# EAGLE design connectors (EAGLE 9.6.2)
Assembly variants: basic
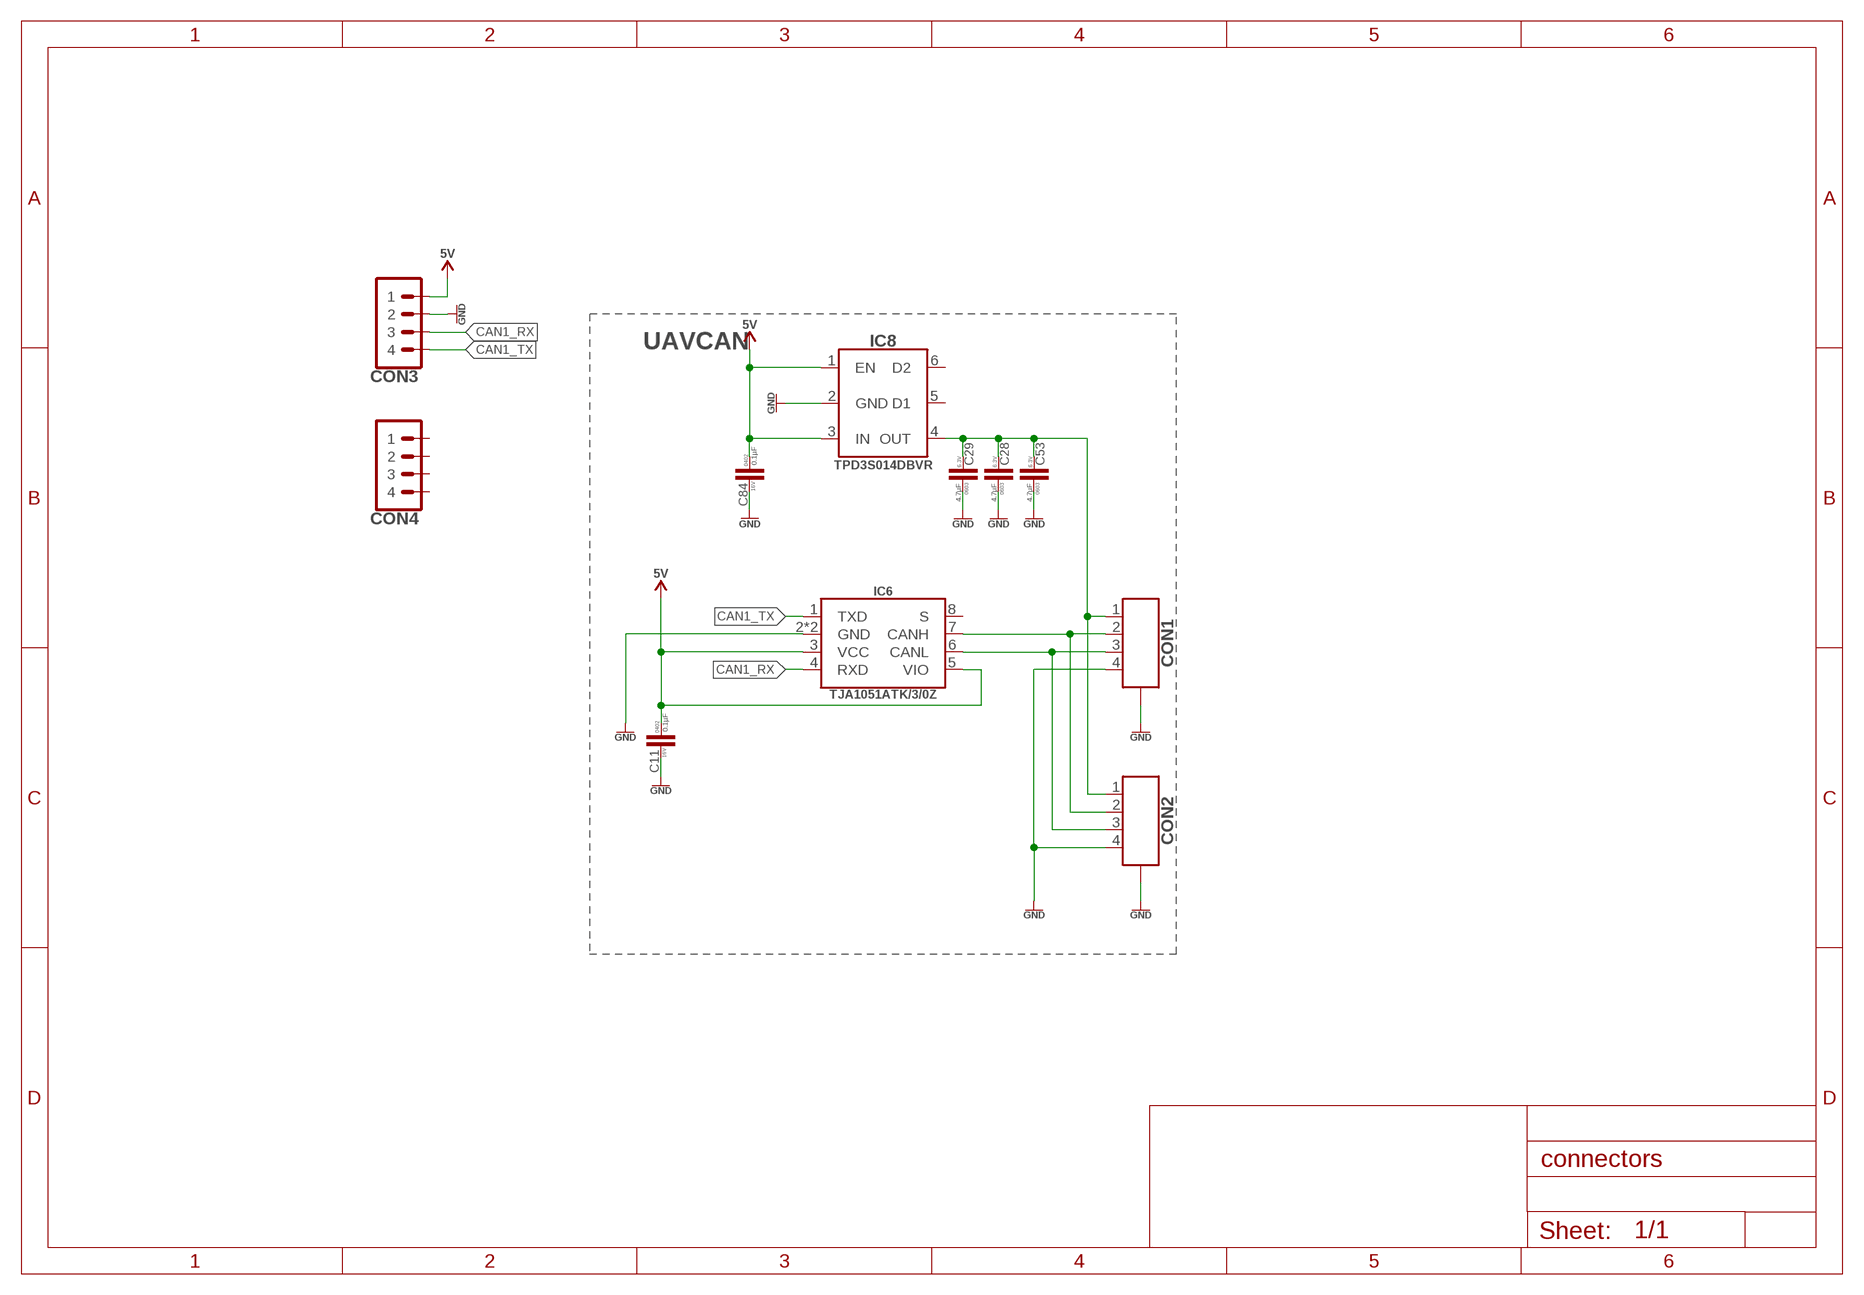
[diagram p0: schematic, sheet 1]

## Parts
C11  0.1µF  C-0402  [C0402]
C28  4.7µF  C-0603  [C0603]
C29  4.7µF  C-0603  [C0603]
C53  4.7µF  C-0603  [C0603]
C84  0.1µF  C-0402  [C0402]
CON1  CON-4P-TABS-JST_GH-RA  [JST_GH-4P-RA]
CON2  CON-4P-TABS-JST_GH-RA  [JST_GH-4P-RA]
CON3  PINHEAD_1X04-2-FEMALE  [1X04-PTH-2-FEMALE]  (not fitted in variant basic)
CON4  PINHEAD_1X04-2-FEMALE  [1X04-PTH-2-FEMALE]  (not fitted in variant basic)
IC6  TJA1051-HVSON8  [SOT782-1]
IC8  TPD3S014DBVR-SOT23-6  [SOT26]

## Nets
CAN1_RX: CON3.3 IC6.4(RXD)
CAN1_TX: CON3.4 IC6.1(TXD)
CAN1_VDD: C28.2 C29.2 C53.2 CON1.1 CON2.1 IC8.4(OUT)
GND: C11.2 C28.1 C29.1 C53.1 C84.2 CON1.4 CON1.M$0(GND) CON1.M$1(GND) CON2.4 CON2.M$0(GND) CON2.M$1(GND) CON3.2 IC6.2(GND) IC6.PAD(GND) IC8.2(GND)
N$23: CON1.2 CON2.2 IC6.7(CANH)
N$25: CON1.3 CON2.3 IC6.6(CANL)
VDD_5V: C11.1 C84.1 CON3.1 IC6.3(VCC) IC6.5(VIO) IC8.1(EN) IC8.3(IN) ; supply symbol labelled 5V
Unconnected: CON4.1 CON4.2 CON4.3 CON4.4 IC6.8(S) IC8.5(D1) IC8.6(D2)

## Notes on the sheet
- UAVCAN

## Library data of the parts
C11 C84 = rc:C; AEC-Q: ---; DIGIKEY#: 490-3261-1-ND; MANF: Murata Electronics; MANF#: GRM155R71C104KA88D; OPERATING_TEMP: -55°C ~ 125°C; PACKAGE: 0402; VOLTAGE: 16V
C28 C29 C53 = rc:C; AEC-Q: ---; DIGIKEY#: 1276-2087-1-ND; MANF: Samsung Electro-Mechanics; MANF#: CL10B475KQ8NQNC; OPERATING_TEMP: -55°C ~ 125°C; PACKAGE: 0603; VOLTAGE: 6.3V
CON1 CON2 = Connectors:CON-4P-TABS: Connector Receptacle 4 Position 0.049" (1.25mm) Tin Surface Mount; DIGIKEY#: 455-1566-1-ND; MANF: JST Sales America Inc; MANF#: SM04B-GHS-TB(LF)(SN)
CON3 CON4 = pinhead:PINHEAD_1X04
IC6 = serial_interfaces:TJA1051: 1/1 Transceiver Half CAN 8-HVSON (3x3); AEC-Q: AEC-Q100; DATA_RATE: 5Mbps; DIGIKEY#: 568-TJA1051ATK/3/0ZTR-ND; MANF: NXP USA Inc.; MANF#: TJA1051ATK/3/0Z; VOLTAGE_SUPPLY: 4.5V ~ 5.5V
IC8 = misc:TPD3S014DBVR: Current Switch Regulator High-Side 500mA SOT-23-6; DIGIKEY#: 296-38835-1-ND; MANF: Texas Instruments; MANF#: TPD3S014DBVR

## Board
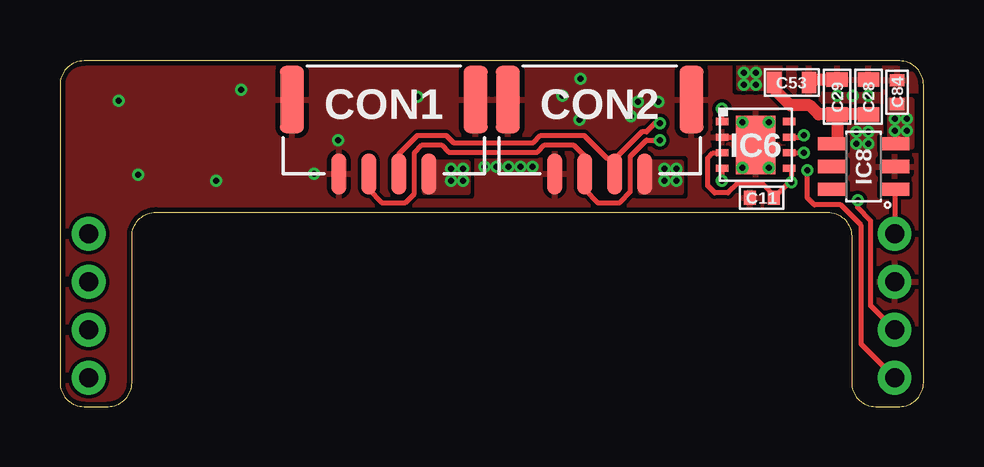
[diagram p1: board, top side]
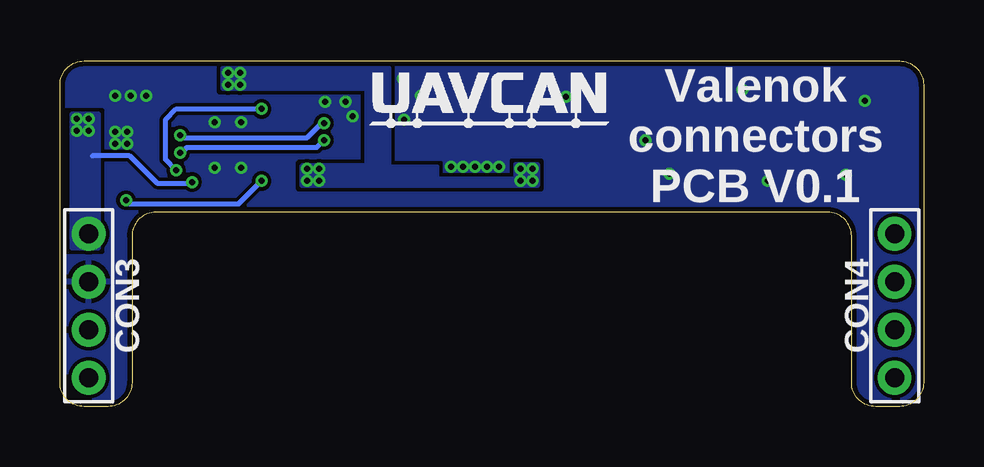
[diagram p2: board, bottom side, seen from below]

Size 36 x 14.4 mm. Coordinates in mm from the lower left corner, seen from the top.
Outline: 35,14.4 1,14.4 arc90 0,13.4 0,1 arc90 1,0 2,0 arc90 3,1 3,7.1 arc-90 4,8.1 32,8.1 arc-90 33,7.1 33,1 arc90 34,0 35,0 arc90 36,1 36,13.4 arc90 35,14.4
Copper layers (1*16): Top 0.035mm / dielectric 1.2mm / Bottom 0.035mm
Design rules "usb2can_drc *": minimum track width 0.15mm, minimum drill 0.2mm, track to track 0.15mm, track to pad 0.15mm, pad to pad 0.15mm, via to via 0.15mm, smd to smd 0.15mm, copper to edge 0.2mm, drill to drill 0.2mm, minimum pad ring 0.125mm, minimum via ring 0.125mm, stop-mask expansion 1mil, vias tented up to drill 0.31mm, thermal gap 8mil

### Footprints (pad centres in the part's own frame; a part is rotated, then mirrored left to right if it is on the bottom)
C0402 = smd 0.5 x 0.6: 1 -0.5,0; 2 0.5,0
C0603 = smd 0.6 x 0.9: 1 -0.725,0; 2 0.725,0
JST_GH-4P-RA = smd 0.6 x 1.7: 1 1.875,-2.91; 2 0.625,-2.91; 3 -0.625,-2.91; 4 -1.875,-2.91 | smd 1 x 2.8: M$0 -3.825,0.19; M$1 3.825,0.19
1X04-PTH-2-FEMALE = drill 0.8 pad 1.4: 1 -3,0; 2 -1,0; 3 1,0; 4 3,0
SOT782-1 = smd 0.525 x 0.3: 1 -1.4,0.975; 2 -1.4,0.325; 3 -1.4,-0.325; 4 -1.4,-0.975; 5 1.4,-0.975; 6 1.4,-0.325; 7 1.4,0.325; 8 1.4,0.975 | smd 1.65 x 2.45: PAD 0,0
SOT26 = smd 1.2 x 0.55: 1 -1.3,0.95; 2 -1.3,0; 3 -1.3,-0.95; 4 1.3,-0.95; 5 1.3,0; 6 1.3,0.95

### Placement (x,y rotation side)
C11  29.25,8.7 180 top
C28  33.7,12.9 270 top
C29  32.4,12.9 270 top
C53  30.5,13.5 180 top
C84  34.9,13.1 90 top
CON1  13.5,12.6 0 top
CON2  22.5,12.6 0 top
CON3  34.8,4.2 270 bottom  (not fitted)
CON4  1.2,4.2 90 bottom  (not fitted)
IC6  29,10.9 0 top
IC8  33.5,10 180 top
U$1  [UAVCAN_10X3]  23.1,11.6 0 bottom

### Tracks (layer width: path | path; a pad name or v marks a point on that pad's centre or on a via)
CAN1_RX  (via drill 0.25 pad 0.5)
  Top 0.2: IC6.4 v27.6,9.4 | CON3.3 33.8,4.2 33.8,7.75 33.25,8.3 v33.25,8.6
  Bottom 0.2: v33.25,8.6 33.1,8.45 28.55,8.45 v27.6,9.4
CAN1_TX  (via drill 0.25 pad 0.5)
  Top 0.2: IC6.1 v27.6,12.4 | CON3.4 33.4,2.6 33.4,7.55 32.55,8.41 31.45,8.41 31.15,8.71 v31.15,9.85
  Bottom 0.2: v31.15,9.85 31.6,10.3 31.6,11.95 31.15,12.4 v27.6,12.4
CAN1_VDD  (via drill 0.25 pad 0.5)
  Top 0.5: C28.2 C29.2 | C29.2 32.4,10.95 IC8.4 | C29.2 31.62,12.18 31.25,12.55 30.45,12.55 29.77,13.23 C53.2
  other vias: 16.3,9.9 25.2,9.9 16.8,9.9 16.3,9.4 25.7,9.9 25.2,9.4 25.7,9.4 16.8,9.4 29,13.4 28.5,13.4 29,13.9 28.5,13.9
  pour Top (no thermals): 15.2,10.2 17,10.2 17,8.9 15.2,8.9
  pour Top (no thermals): 24.2,10.2 25.9,10.2 25.9,8.9 24.2,8.9
  pour Bottom (no thermals): 25.9,10.05 23.2,10.05 23.2,13.25 29.2,13.25 29.2,14.1 22.3,14.1 22.3,10 20.3,10 20.3,9.5 17,9.5 17,10.1 16.1,10.1 16.1,9.2 25.9,9.2
  pour Top (no thermals): 30,13.25 28.3,13.25 28.3,14.2 30,14.2
GND  (via drill 0.25 pad 0.5)
  Top 0.2: IC6.2 28.68,11.23 IC6.PAD
  Top 0.5: C29.1 31.35,13.62 C53.1
  other vias: 10.6,9.7 11.6,11.1 19.7,10 19.2,10 18.7,10 18.2,10 17.7,10 33.7,11.45 33.7,10.95 33.2,10.95 33.7,12.95 33.05,12.95 32.4,12.95 29.55,9.95 28.45,9.95 28.45,11.85 29.55,11.85 33.2,11.45 7.55,13.2 2.45,12.75 3.25,9.65 6.5,9.4 14.9,12.9 21.7,13.65 20.95,12.95 24.1,12.7 23.8,12.1 24.95,12.7 21.65,11.95
  pour Top (rank 3): 0,14.4 36,14.4 36,-0.6 0,-0.6
  pour Bottom (rank 3): 0,14.4 36,14.4 36,-0.6 0,-0.6
N$23  (via drill 0.25 pad 0.5)
  Top 0.2: IC6.7 31,11.23 v31,11.3 | CON1.2 14.12,10.53 14.9,11.3 16.1,11.3 16.4,11 19.73,11 20.03,11.3 21.85,11.3 22.8,10.35 23.1,10.35 | v25,11.8 24.8,11.8 24.45,11.45 24.25,11.45 23.16,10.35 23.1,10.35 | CON2.2 23.1,9.72 23.1,10.35
  Bottom 0.2: v25,11.8 25.1,11.8 25.7,11.2 30.9,11.2 v31,11.3
N$25  (via drill 0.25 pad 0.5)
  Top 0.2: IC6.6 v31,10.58 | CON1.3 12.88,9.03 13.4,8.5 14.4,8.5 14.78,8.88 14.78,10.58 15.1,10.9 15.9,10.9 16.2,10.6 19.9,10.6 20.2,10.9 21.4,10.9 21.88,10.43 CON2.3 21.88,9.03 22.4,8.5 23.33,8.5 23.77,8.94 23.77,10.43 24.45,11.1 v25,11.1
  Bottom 0.2: v31,10.58 30.93,10.58 30.7,10.8 25.3,10.8 v25,11.1
VDD_5V  (via drill 0.25 pad 0.5)
  Top 0.2: IC6.3 27.23,10.58 27,10.35 27,9.2 27.3,8.9 27.85,8.9 28.25,9.3 29.25,9.3 29.85,8.7 C11.1 30.41,9.36 v30.49,9.36 30.49,9.84 IC6.5 | IC8.1 CON3.1
  Top 0.5: IC8.3 34.9,11.05
  Bottom 0.2: v30.49,9.36 30.54,9.31 31.95,9.31 33.1,10.45 34.65,10.45
  other vias: 34.8,12 35.3,12 35.3,11.5 34.8,11.5
  pour Top (no thermals): 34.6,12.8 35.5,12.8 35.5,10.8 34.6,10.8
  pour Bottom (no thermals): 35.5,12.2 34.4,12.2 34.4,6.6 35.5,6.6

### Text on the board
bPlace: Valenok / connectors / PCB V0.1